# Altium schematic sheet [4]-WIFI Module WF60.SchDoc
size A3; Organization: Altium Limited; Address1: L3, 12a Rodborough Rd; Address2: Frenchs Forest; Address3: NSW; Address4: Australia 2086
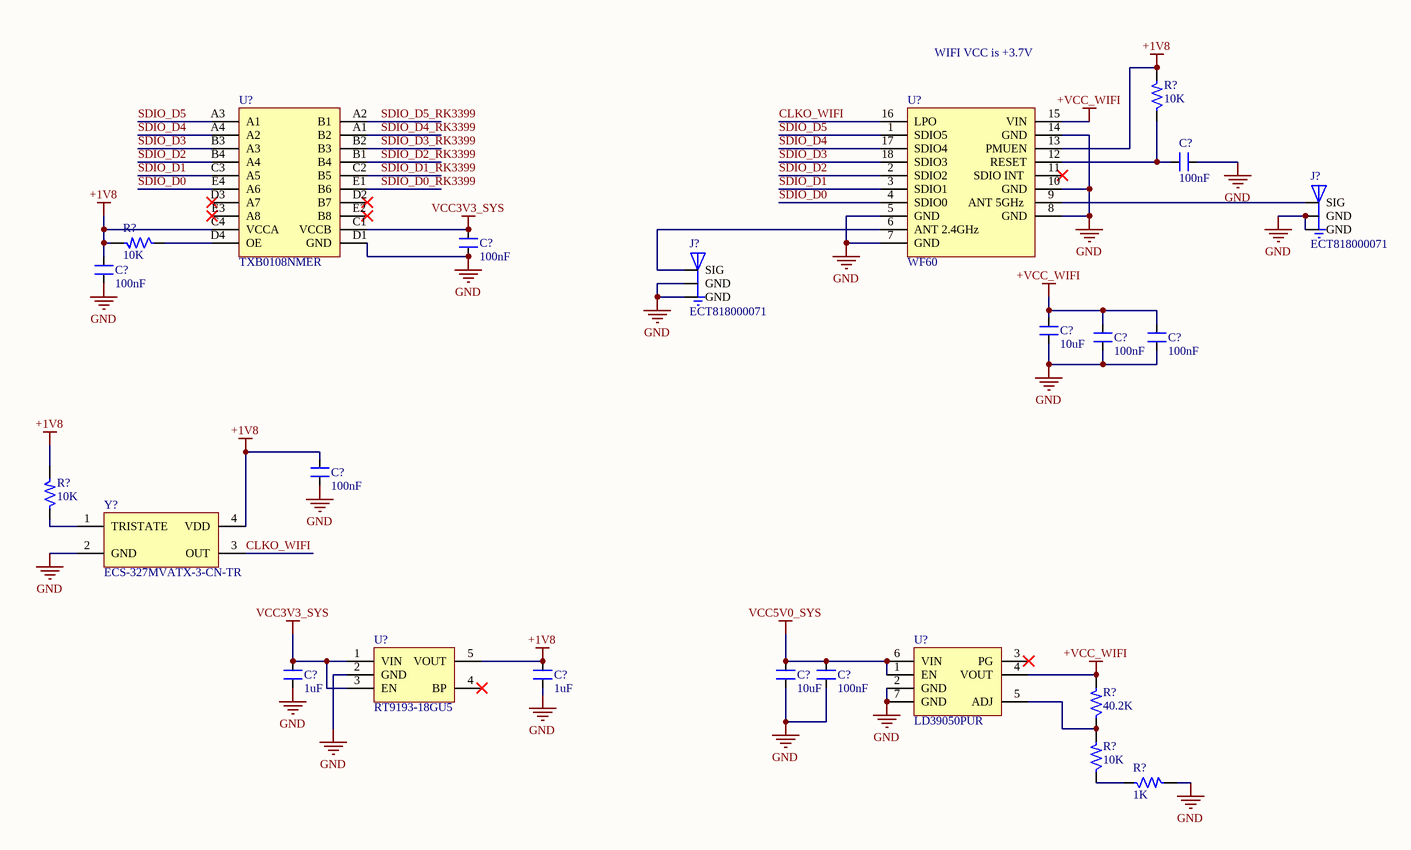
[diagram p0: [4]-WIFI Module WF60.SchDoc]

## Parts
(Parts that share a designator on the sheet are numbered #1, #2 ... from top to bottom, then left to right.)
C?#1  100nF  [CAP_0201]
C?#2  100nF  [CAP_0201]
C?#3  100nF  [CAP_0201]
C?#4  10uF  [CAP_0603]
C?#5  100nF  [CAP_0201]
C?#6  100nF  [CAP_0201]
C?#7  100nF  [CAP_0201]
C?#8  1uF  [CAP_0201]
C?#9  1uF  [CAP_0201]
C?#10  10uF  [CAP_0603]
C?#11  100nF  [CAP_0201]
J?#1  ECT818000071  [CON3_UFL_116_SMD_ST]
J?#2  ECT818000071  [CON3_UFL_116_SMD_ST]
R?#1  10K  [RES_0201]
R?#2  10K  [RES_0201]
R?#3  10K  [RES_0201]
R?#4  40.2K  [RES_0201]
R?#5  10K  [RES_0201]
R?#6  1K  [RES_0201]
U?#1  TXB0108NMER  [NFBGA_31.4_125.9X102.36]
U?#2  WF60  [MOD_WF60]
U?#3  RT9193-18GU5  [SC70-5]
U?#4  LD39050PUR  [DFN-6_37.4_165_33X15_SMD]
Y?  ECS-327MVATX-3-CN-TR  [XTAL_57_35X31_SMD]

## Nets
+1V8: C?#3.2 C?#7.2 C?#9.2 R?#1.2 R?#2.2 R?#3.2 U?#1.C4(VCCA) U?#2.13(PMUEN) U?#3.5(VOUT) Y?.4(VDD)
+VCC_WIFI: C?#4.2 C?#5.2 C?#6.2 R?#4.2 U?#2.15(VIN) U?#4.4(VOUT)
GND: C?#1.1 C?#2.1 C?#3.1 C?#4.1 C?#5.1 C?#6.1 C?#7.1 C?#8.1 C?#9.1 C?#10.1 C?#11.1 J?#1.1(GND) J?#1.3(GND) J?#2.1(GND) J?#2.3(GND) R?#6.2 U?#1.D1(GND) U?#2.5(GND) U?#2.7(GND) U?#2.8(GND) U?#2.10(GND) U?#2.14(GND) U?#3.2(GND) U?#4.2(GND) U?#4.7(GND) Y?.2(GND)
VCC3V3_SYS: C?#2.2 C?#8.2 U?#1.C1(VCCB) U?#3.1(VIN) U?#3.3(EN)
VCC5V0_SYS: C?#10.2 C?#11.2 U?#4.1(EN) U?#4.6(VIN)
CLKO_WIFI: U?#2.16(LPO) Y?.3(OUT)
SDIO_D0: U?#1.E4(A6) U?#2.4(SDIO0)
SDIO_D0_RK3399: U?#1.E1(B6)
SDIO_D1: U?#1.C3(A5) U?#2.3(SDIO1)
SDIO_D1_RK3399: U?#1.C2(B5)
SDIO_D2: U?#1.B4(A4) U?#2.2(SDIO2)
SDIO_D2_RK3399: U?#1.B1(B4)
SDIO_D3: U?#1.B3(A3) U?#2.18(SDIO3)
SDIO_D3_RK3399: U?#1.B2(B3)
SDIO_D4: U?#1.A4(A2) U?#2.17(SDIO4)
SDIO_D4_RK3399: U?#1.A1(B2)
SDIO_D5: U?#1.A3(A1) U?#2.1(SDIO5)
SDIO_D5_RK3399: U?#1.A2(B1)
NetC?#1_2: C?#1.2 R?#1.1 U?#2.12(RESET)
NetJ?#1_2: J?#1.2(SIG) U?#2.9(ANT_5GHz)
NetJ?#2_2: J?#2.2(SIG) U?#2.6(ANT_2.4GHz)
NetR?#2_1: R?#2.1 U?#1.D4(OE)
NetR?#3_1: R?#3.1 Y?.1(TRISTATE)
NetR?#4_1: R?#4.1 R?#5.2 U?#4.5(ADJ)
NetR?#5_1: R?#5.1 R?#6.1

Not connected (* = marked no-connect by the designer): U?#1 D2(B7)* D3(A7)* E2(B8)* E3(A8)*; U?#2 11(SDIO_INT_)*; U?#3 4(BP)*; U?#4 3(PG)*

## Notes on the sheet
- WIFI VCC is +3.7V
- Title
- Size:
- Date:
- A3
- Number:
- Time:
- Revision:
- Sheet
- of
- File:

## Library data of the parts
C?#1-C?#3 C?#5-C?#7 C?#11 = CAP_100nF-25V-10%-0201: 0.1µF ±10% 25V Ceramic Capacitor X5R 0201 (0603 Metric) /; Manufacturer: TDK Corporation; Manufacturer Part Number: C0603X5R1E104K030BB; Case/Package: 0201; Supplier-1: Digikey
C?#4 C?#10 = CAP_10uF-10V-10%-0603: 10µF ±10% 10V Ceramic Capacitor X5R 0603 (1608 Metric) /; Manufacturer Part Number: GRM188R61A106KE69J; Manufacturer: Murata Electronics; Case/Package: 0603; Supplier-1: Digikey
C?#8 C?#9 = CAP_1uF-16V-10%-0201: 1µF ±20% 16V Ceramic Capacitor X5R 0201 (0603 Metric) /; Manufacturer: Samsung Electro-Mechanics; Manufacturer Part Number: CL03A105MO3NRNH; Case/Package: 0201; Supplier-1: Digikey
J?#1 J?#2 = CON-PLG_3X1-ECT818000071-ST-SMD: SMD RF Connectors/Coaxial Connectors RoHS; Manufacturer: ECT; Manufacturer Part Number: ECT818000071; Case/Package: SMD; Supplier-1: LCSC
R?#1-R?#3 R?#5 = RES_10K-0.05W-1%-0201: 10 kOhms ±1% 0.05W, 1/20W Chip Resistor 0201 (0603 Metric) Thick Film /; Manufacturer: Stackpole Electronics Inc; Manufacturer Part Number: RMCF0201FT10K0; Case/Package: 0201; Supplier-1: Digikey
R?#4 = RES_40.2K-0.05W-1%-0201: 40.2 kOhms ±1% 0.05W, 1/20W Chip Resistor 0201 (0603 Metric) Automotive AEC-Q200, Moisture Resistant Thick Film /; Manufacturer: Yageo; Manufacturer Part Number: AC0201FR-0740K2L; Case/Package: 0201; Supplier-1: Digikey
R?#6 = RES_1K-0.05W-1%-0201: 1 kOhms ±1% 0.05W, 1/20W Chip Resistor 0201 (0603 Metric) Thick Film /; Manufacturer: Yageo; Manufacturer Part Number: RC0201FR-071KL; Case/Package: 0201; Supplier-1: Digikey
U?#1 = IC_TXB0108NMER: Translation - Voltage Levels 8-Bit Bidirectional Voltage-Level Shifter with Auto Direction Sensing and +/-15-kV ESD Protect; Manufacturer: Texas Instruments; Manufacturer Part Number: TXB0108NMER; Case/Package: NFBGA-20; Supplier-1: Mouser
U?#2 = MOD_WF60-SMD: Amp’ed RF Tech presents the WF60 WiFi dual / band module: 802.11abgn.; Nymble Part Number: 1EA-AA-0568; Alternate Part Number-1: NA; Manufacturer: Amp’ed; Manufacturer Part Number: WF60; Case/Package: SMD; Supplier-1: Arrow; Supplier Part Number-1: WF60; Category: Module; Number of Pins: 16
U?#3 = REG_1.8V-300mA-5.5V-SC70-5: Linear Voltage Regulator IC 1 Output 300mA SC-70-5; Manufacturer: Richtek USA Inc.; Manufacturer Part Number: RT9193-18GU5; Case/Package: SC70-5; Supplier-1: Digikey
U?#4 = REG_5.5V-0~5.1V-0.5A-2.55W-DFN-6: Adjustable 5.5V 0.8V 500mA DFN-6 Linear Voltage Regulators RoHS; Manufacturer: STMicroelectronics; Nymble Part Number: 1EA-AA-0572; Alternate Part Number-1: NA; Manufacturer Part Number: LD39050PUR; Case/Package: DFN-6; Supplier-1: LCSC; Supplier Part Number-1: C222094; Category: Regulators; Number of Pins: 6
Y? = XTAL_ECS-327MVATX-2-CN-TR: 32.768kHz XO (Standard) CMOS Oscillator 1.6V ~ 3.6V Enable/Disable 4-SMD, No Lead; Manufacturer: ECS INC; Nymble Part Number: 1EA-AA-0561; Alternate Part Number-1: NA; Manufacturer Part Number: ECS-327MVATX-3-CN-TR; Case/Package: SMD-4; Supplier-1: Digikey; Supplier Part Number-1: ECS-327MVATX-3-CN-TR; Category: Crystal; Number of Pins: 4